# Altium schematic sheet LPCB219 - NODE CORE.SchDoc
size A3; Address1: Factory 10; Address2: 9-13 Dingley Avenue, Dandeong, VICTORIA 3175, AUSTRALIA; DocumentNumber: 5; Revision: 1; SheetNumber: 5; SheetTotal: 7; Lockie__PCB_SUB_ASSEMBLY: Core; Lockie__PCB_ASSEMBLY: Main; Lockie__LDL: LPCB219; Lockie__PCB_DESCRIPTION: Control Node
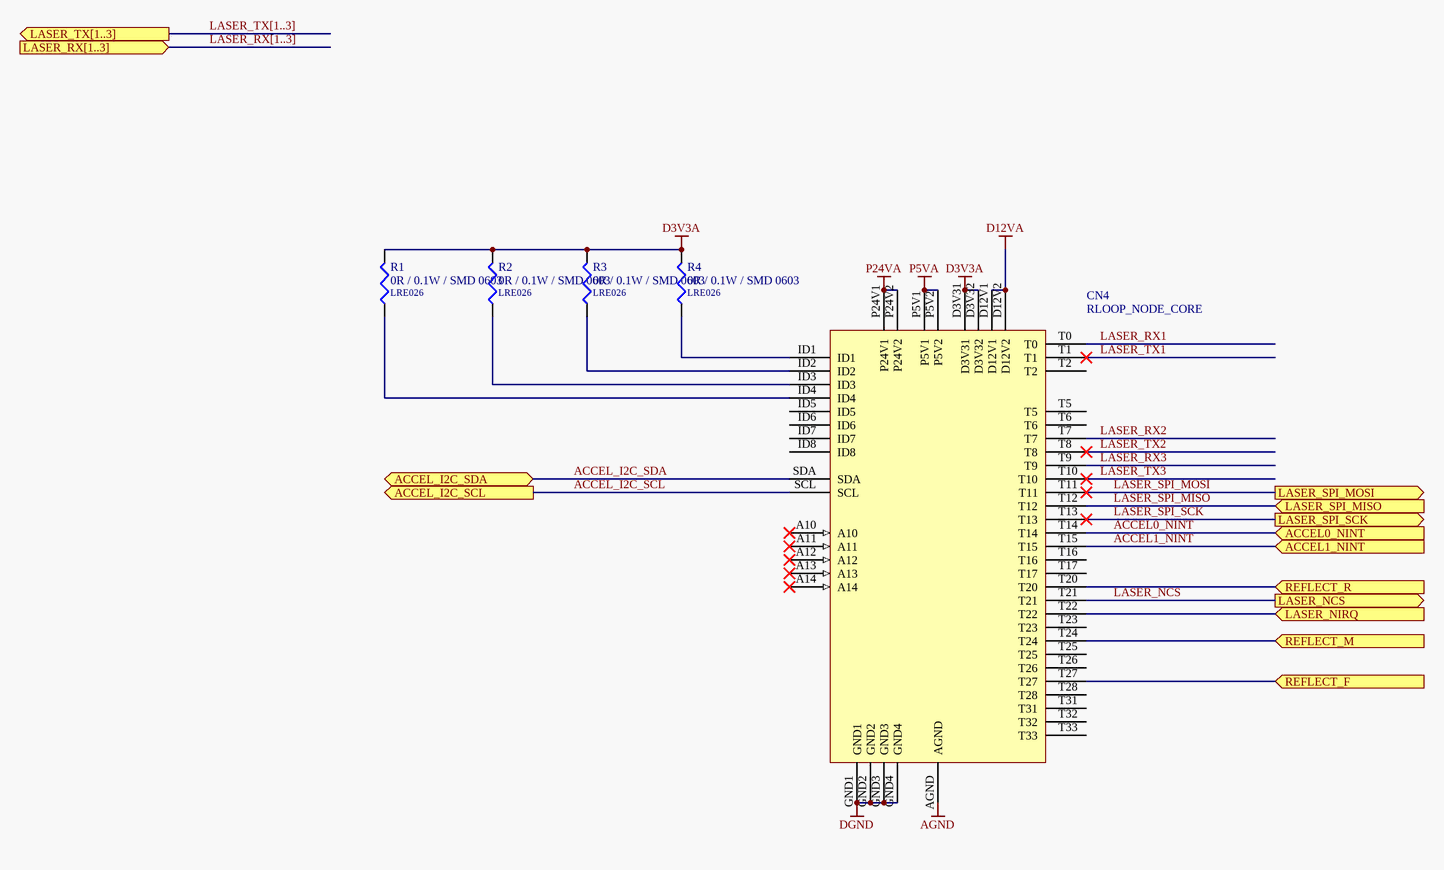
[diagram p0: LPCB219 - NODE CORE.SchDoc]

## Parts
CN4  RLOOP_NODE_CORE  [RLOOP_NODE_CORE]  (no BOM)
R1  0R / 0.1W / SMD 0603  LDL_NUMBER: LRE026  [LFP020__CR1608-0603-IPC7351_B]
R2  0R / 0.1W / SMD 0603  LDL_NUMBER: LRE026  [LFP020__CR1608-0603-IPC7351_B]
R3  0R / 0.1W / SMD 0603  LDL_NUMBER: LRE026  [LFP020__CR1608-0603-IPC7351_B]
R4  0R / 0.1W / SMD 0603  LDL_NUMBER: LRE026  [LFP020__CR1608-0603-IPC7351_B]

## Ports
ACCEL0_NINT (in), ACCEL1_NINT (in), ACCEL_I2C_SCL (out), ACCEL_I2C_SDA (bidir), LASER_NCS (out), LASER_NIRQ (in), LASER_RX[1..3] (in), LASER_SPI_MISO (in), LASER_SPI_MOSI (out), LASER_SPI_SCK (out), LASER_TX[1..3] (out), REFLECT_F (in), REFLECT_M (in), REFLECT_R (in)

## Nets
AGND: CN4.AGND
D3V3A: CN4.D3V31 CN4.D3V32 R1.2 R2.2 R3.2 R4.2
D12VA: CN4.D12V1 CN4.D12V2
DGND: CN4.GND1 CN4.GND2 CN4.GND3 CN4.GND4
P5VA: CN4.P5V1 CN4.P5V2
P24VA: CN4.P24V1 CN4.P24V2
ACCEL0_NINT: CN4.T14 ; port ACCEL0_NINT
ACCEL1_NINT: CN4.T15 ; port ACCEL1_NINT
ACCEL_I2C_SCL: CN4.SCL ; port ACCEL_I2C_SCL
ACCEL_I2C_SDA: CN4.SDA ; port ACCEL_I2C_SDA
LASER_NCS: CN4.T21 ; port LASER_NCS
LASER_NIRQ: CN4.T22 ; port LASER_NIRQ
LASER_RX1: CN4.T0
LASER_RX2: CN4.T7
LASER_RX3: CN4.T9
LASER_SPI_MISO: CN4.T12 ; port LASER_SPI_MISO
LASER_SPI_MOSI: CN4.T11 ; port LASER_SPI_MOSI
LASER_SPI_SCK: CN4.T13 ; port LASER_SPI_SCK
LASER_TX1: CN4.T1
LASER_TX2: CN4.T8
LASER_TX3: CN4.T10
REFLECT_F: CN4.T27 ; port REFLECT_F
REFLECT_M: CN4.T24 ; port REFLECT_M
REFLECT_R: CN4.T20 ; port REFLECT_R
NetCN4_ID1: CN4.ID1 R4.1
NetCN4_ID2: CN4.ID2 R3.1
NetCN4_ID3: CN4.ID3 R2.1
NetCN4_ID4: CN4.ID4 R1.1

Not connected (* = marked no-connect by the designer): CN4 A10* A11* A12* A13* A14* ID5 ID6 ID7 ID8 T2 T5 T6 T16 T17 T23 T25 T26 T28 T31 T32 T33

## Buses and harness runs
bus LASER_RX[1..3] = port LASER_RX[1..3]
bus LASER_TX[1..3] = port LASER_TX[1..3]

## Notes on the sheet
- PCB COMPONENT DESCRIPTION
- LDL NUMBER
- Assembly Details
- Size
- Drawing File Name
- Revision
- http://rloop.org
- Scale
- A3
- Sheet Details
- N.T.S
- Sheet:
- Of:

## Library data of the parts
CN4 = RLOOP_NODE_CORE: rLoop Node Core Connector; FMEDA__CHANNEL: COM; FMEDA__OPERATING__CURRENT_MAX: 0; FMEDA__OPERATING__TEMP_MAX: 50; FMEDA__OPERATING__TEMP_MIN: -20; FMEDA__OPERATING__TEMP_TYP: 27; FMEDA__OPERATING__VOLTAGE_MAX: 16; FMEDA__OPERATING__VOLTAGE_TYP: 12; FMEDA__OPERATING__CURRENT_MIN: 0; FMEDA__OPERATING__CURRENT_TYP: 0; FMEDA__OPERATING__VOLTAGE_MIN: 0
R1-R4 = 0R / 0.1W / SMD 0603: Resistor, Ceramic Chip, 0R, 0.1W, SMD 0603 [LRE026]; Value: 0; FMEDA__OPERATING__TEMP_MAX: 50; FMEDA__OPERATING__TEMP_MIN: -20; FMEDA__OPERATING__TEMP_TYP: 27; FMEDA__CHANNEL: COM; FMEDA__OPERATING__POWER_MAX: 0; FMEDA__OPERATING__POWER_MIN: 0; FMEDA__OPERATING__VOLTAGE_MAX: 0; FMEDA__OPERATING__VOLTAGE_MIN: 0; FMEDA__OPERATING__VOLTAGE_TYP: 0; FMEDA__FUNCTION_IN_SYSTEM: *